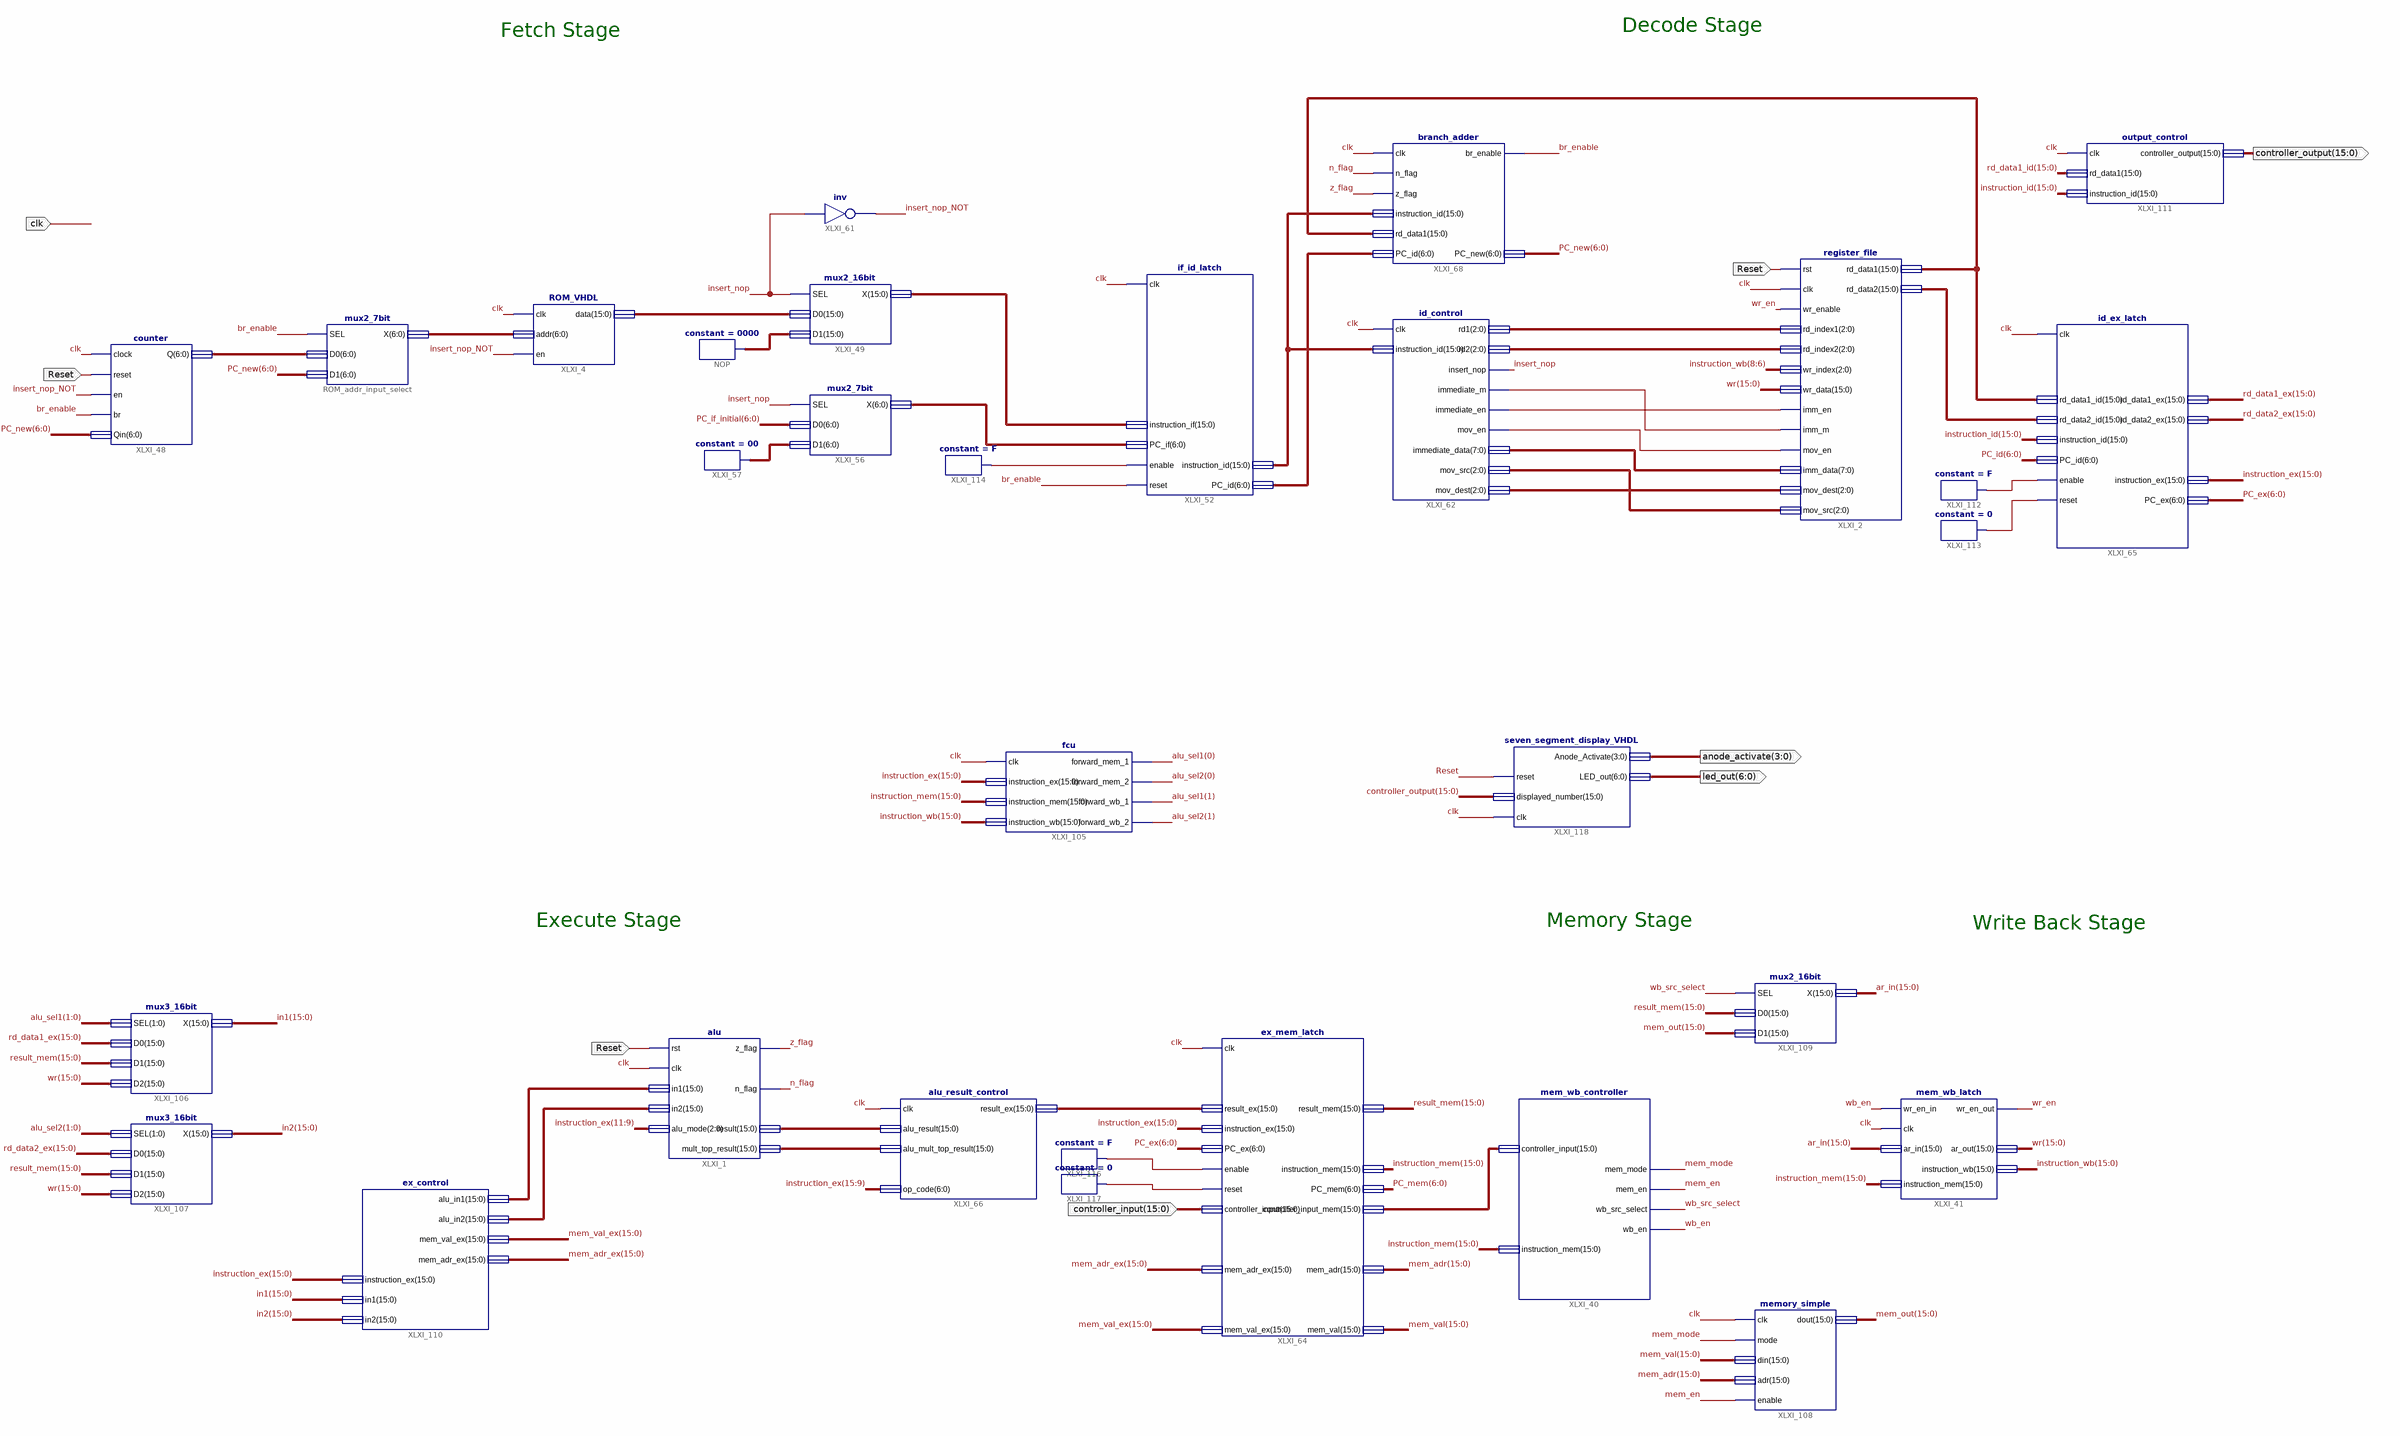
[diagram p0: schematic sheet 1]
// Xilinx ISE schematic processor.sch (spartan3e) as structural Verilog: 31 symbols, 6 ports
module processor (
  input  clk,
  input  [15:0] controller_input,
  input  Reset,
  output [15:0] controller_output,
  output [3:0] anode_activate,
  output [6:0] led_out
);

  wire br_enable, insert_nop, insert_nop_NOT, mem_en, mem_mode, n_flag, wb_en, wb_src_select, wr_en,
       XLXN_1089, XLXN_1090, XLXN_1092, XLXN_1096, XLXN_1097, XLXN_1098, XLXN_1099, XLXN_1100, z_flag;
  wire [1:0] alu_sel1, alu_sel2;
  wire [2:0] rf_rd1, rf_rd2, XLXN_1094, XLXN_1095;
  wire [6:0] PC_counter, PC_ex, PC_id, PC_if, PC_if_initial, PC_mem, PC_new, XLXN_320;
  wire [7:0] XLXN_1093;
  wire [15:0] alu_in1, alu_in2, alu_result, alu_top_result, ar_in, controller_input_mem, in1, in2,
       instruction_ex, instruction_id, instruction_if, instruction_mem, instruction_wb, mem_adr, mem_adr_ex,
       mem_out, mem_val, mem_val_ex, rd_data1_ex, rd_data1_id, rd_data2_ex, rd_data2_id, result_ex,
       result_mem, wr, XLXN_299, XLXN_1088;

  counter XLXI_48 (.clock(clk), .reset(Reset), .en(insert_nop_NOT), .br(br_enable), .Qin(PC_new), .Q(PC_counter));
  mux2_7bit ROM_addr_input_select (.SEL(br_enable), .D0(PC_counter), .D1(PC_new), .X(PC_if_initial));
  ROM_VHDL XLXI_4 (.clk(clk), .addr(PC_if_initial), .data(XLXN_1088), .en(insert_nop_NOT));
  mux2_7bit XLXI_56 (.SEL(insert_nop), .D0(PC_if_initial), .D1(XLXN_320), .X(PC_if));
  constant #(.CValue("00")) XLXI_57 (.O(XLXN_320));
  mux2_16bit XLXI_49 (.SEL(insert_nop), .D0(XLXN_1088), .D1(XLXN_299), .X(instruction_if));
  constant #(.CValue("0000")) NOP (.O(XLXN_299));
  not XLXI_61 (insert_nop_NOT, insert_nop);
  if_id_latch XLXI_52 (
    .clk(clk), .reset(br_enable), .enable(XLXN_1098), .instruction_id(instruction_id), .PC_id(PC_id),
    .instruction_if(instruction_if), .PC_if(PC_if));
  branch_adder XLXI_68 (
    .clk(clk), .n_flag(n_flag), .z_flag(z_flag), .instruction_id(instruction_id), .rd_data1(rd_data1_id),
    .PC_id(PC_id), .br_enable(br_enable), .PC_new(PC_new));
  id_ex_latch XLXI_65 (
    .clk(clk), .enable(XLXN_1096), .reset(XLXN_1097), .rd_data1_id(rd_data1_id), .rd_data2_id(rd_data2_id),
    .instruction_id(instruction_id), .PC_id(PC_id), .instruction_ex(instruction_ex), .PC_ex(PC_ex),
    .rd_data1_ex(rd_data1_ex), .rd_data2_ex(rd_data2_ex));
  id_control XLXI_62 (
    .clk(clk), .instruction_id(instruction_id), .insert_nop(insert_nop), .rd1(rf_rd1), .rd2(rf_rd2),
    .immediate_m(XLXN_1089), .immediate_en(XLXN_1090), .mov_en(XLXN_1092), .immediate_data(XLXN_1093),
    .mov_src(XLXN_1094), .mov_dest(XLXN_1095));
  register_file XLXI_2 (
    .rst(Reset), .clk(clk), .wr_enable(wr_en), .imm_en(XLXN_1090), .imm_m(XLXN_1089), .mov_en(XLXN_1092),
    .rd_index1(rf_rd1), .rd_index2(rf_rd2), .wr_index(instruction_wb[8:6]), .wr_data(wr),
    .imm_data(XLXN_1093), .mov_dest(XLXN_1095), .mov_src(XLXN_1094), .rd_data1(rd_data1_id),
    .rd_data2(rd_data2_id));
  fcu XLXI_105 (
    .clk(clk), .instruction_ex(instruction_ex), .instruction_mem(instruction_mem),
    .instruction_wb(instruction_wb), .forward_mem_1(alu_sel1[0]), .forward_mem_2(alu_sel2[0]),
    .forward_wb_1(alu_sel1[1]), .forward_wb_2(alu_sel2[1]));
  mux3_16bit XLXI_107 (.SEL(alu_sel2), .D0(rd_data2_ex), .D1(result_mem), .D2(wr), .X(in2));
  mux3_16bit XLXI_106 (.SEL(alu_sel1), .D0(rd_data1_ex), .D1(result_mem), .D2(wr), .X(in1));
  ex_mem_latch XLXI_64 (
    .clk(clk), .enable(XLXN_1099), .reset(XLXN_1100), .result_ex(result_ex), .instruction_ex(instruction_ex),
    .PC_ex(PC_ex), .controller_input(controller_input), .controller_input_mem(controller_input_mem),
    .result_mem(result_mem), .instruction_mem(instruction_mem), .PC_mem(PC_mem), .mem_adr_ex(mem_adr_ex),
    .mem_val_ex(mem_val_ex), .mem_adr(mem_adr), .mem_val(mem_val));
  alu_result_control XLXI_66 (
    .clk(clk), .alu_result(alu_result), .alu_mult_top_result(alu_top_result), .result_ex(result_ex),
    .op_code(instruction_ex[15:9]));
  alu XLXI_1 (
    .rst(Reset), .clk(clk), .in1(alu_in1), .in2(alu_in2), .alu_mode(instruction_ex[11:9]), .z_flag(z_flag),
    .n_flag(n_flag), .result(alu_result), .mult_top_result(alu_top_result));
  mem_wb_latch XLXI_41 (
    .wr_en_in(wb_en), .clk(clk), .ar_in(ar_in), .instruction_mem(instruction_mem), .wr_en_out(wr_en),
    .instruction_wb(instruction_wb), .ar_out(wr));
  mem_wb_controller XLXI_40 (
    .instruction_mem(instruction_mem), .controller_input(controller_input_mem), .wb_en(wb_en),
    .wb_src_select(wb_src_select), .mem_mode(mem_mode), .mem_en(mem_en));
  memory_simple XLXI_108 (.clk(clk), .enable(mem_en), .mode(mem_mode), .din(mem_val), .adr(mem_adr), .dout(mem_out));
  mux2_16bit XLXI_109 (.SEL(wb_src_select), .D0(result_mem), .D1(mem_out), .X(ar_in));
  ex_control XLXI_110 (
    .instruction_ex(instruction_ex), .alu_in1(alu_in1), .alu_in2(alu_in2), .mem_val_ex(mem_val_ex),
    .mem_adr_ex(mem_adr_ex), .in1(in1), .in2(in2));
  output_control XLXI_111 (
    .clk(clk), .rd_data1(rd_data1_id), .instruction_id(instruction_id), .controller_output(controller_output));
  constant #(.CValue("F")) XLXI_112 (.O(XLXN_1096));
  constant #(.CValue("0")) XLXI_113 (.O(XLXN_1097));
  constant #(.CValue("F")) XLXI_114 (.O(XLXN_1098));
  constant #(.CValue("F")) XLXI_116 (.O(XLXN_1099));
  constant #(.CValue("0")) XLXI_117 (.O(XLXN_1100));
  seven_segment_display_VHDL XLXI_118 (
    .reset(Reset), .displayed_number(controller_output), .Anode_Activate(anode_activate), .LED_out(led_out),
    .clk(clk));

  // Notes on the sheet:
  //   Decode Stage
  //   Fetch Stage
  //   Execute Stage
  //   Memory Stage
  //   Write Back Stage
endmodule
